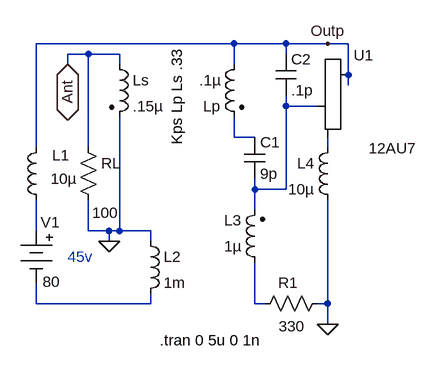
[diagram p0: schematic 6C4_Osc.asc]
6C4_Osc.asc, the LTspice schematic file:
Version 4
SHEET 1 880 680
WIRE -528 256 -528 96
WIRE -528 384 -528 336
WIRE -528 496 -528 464
WIRE -480 128 -480 112
WIRE -448 112 -480 112
WIRE -448 256 -448 112
WIRE -448 384 -448 336
WIRE -416 384 -448 384
WIRE -416 400 -416 384
WIRE -400 112 -448 112
WIRE -400 128 -400 112
WIRE -400 384 -416 384
WIRE -400 384 -400 208
WIRE -352 384 -400 384
WIRE -352 400 -352 384
WIRE -352 496 -528 496
WIRE -352 496 -352 480
WIRE -224 96 -528 96
WIRE -224 128 -224 96
WIRE -224 240 -224 208
WIRE -192 240 -224 240
WIRE -192 320 -192 304
WIRE -192 352 -192 320
WIRE -192 496 -192 432
WIRE -176 496 -192 496
WIRE -144 96 -224 96
WIRE -144 112 -144 96
WIRE -144 192 -144 176
WIRE -144 320 -192 320
WIRE -144 320 -144 192
WIRE -96 192 -144 192
WIRE -80 96 -144 96
WIRE -80 256 -80 240
WIRE -80 496 -96 496
WIRE -80 496 -80 336
WIRE -80 528 -80 496
WIRE -48 96 -80 96
WIRE -48 144 -48 96
WIRE -48 160 -48 144
FLAG -80 528 0
FLAG -416 400 0
FLAG -480 128 Ant
IOPIN -480 128 BiDir
FLAG -80 96 Outp
SYMBOL Valve\\triode -48 192 R0
WINDOW 38 68 65 Center 0
SYMATTR SpiceModel 12AU7
SYMATTR InstName U1
SYMBOL Misc\\battery -528 368 M0
WINDOW 0 -21 -13 Top 0
WINDOW 3 -23 110 Bottom 0
WINDOW 123 0 0 Left 0
SYMATTR InstName V1
SYMATTR Value 80
SYMATTR SpiceLine Rser=1m Cpar=10n
SYMBOL ind -512 352 R180
WINDOW 0 -22 69 Top 0
WINDOW 3 -26 64 Bottom 0
SYMATTR InstName L1
SYMATTR Value 10µ
SYMATTR SpiceLine Ipk=0.21 Rser=1.35 Rpar=0 Cpar=0 mfg="Coilcraft" pn="0603PS-103M"
SYMBOL ind2 -208 112 M0
WINDOW 0 36 80 Left 0
WINDOW 3 36 40 Left 0
SYMATTR InstName Lp
SYMATTR Value .1µ
SYMATTR SpiceLine Ipk=20 Rser=0.00165 Rpar=0 Cpar=0 mfg="WE eiSos" pn="744 312 011"
SYMBOL ind2 -176 448 R180
WINDOW 0 36 80 Left 0
WINDOW 3 36 40 Left 0
SYMATTR InstName L3
SYMATTR Value 1µ
SYMATTR SpiceLine Ipk=4.2 Rser=0.007 Rpar=0 Cpar=0 mfg="Coiltronics" pn="CTX1-1"
SYMBOL res -80 480 R90
WINDOW 0 -16 45 VRight 0
WINDOW 3 51 35 VRight 0
SYMATTR InstName R1
SYMATTR Value 330
SYMATTR SpiceLine tol=1 pwr=0.1
SYMBOL ind -64 240 M0
SYMATTR InstName L4
SYMATTR Value 10µ
SYMATTR SpiceLine Ipk=0.21 Rser=1.35 Rpar=0 Cpar=0 mfg="Coilcraft" pn="0603PS-103M"
SYMBOL cap -208 240 R0
SYMATTR InstName C1
SYMATTR Value 9p
SYMBOL cap -160 112 R0
SYMATTR InstName C2
SYMATTR Value .1p
SYMBOL ind2 -416 112 R0
SYMATTR InstName Ls
SYMATTR Value .15µ
SYMATTR Type ind
SYMATTR SpiceLine Ipk=0.4 Rser=0.26 Rpar=0 Cpar=0
SYMBOL res -464 240 R0
WINDOW 3 22 116 Left 0
SYMATTR Value 100
SYMATTR InstName RL
SYMATTR SpiceLine tol=1 pwr=0.1
SYMBOL ind -368 384 R0
SYMATTR InstName L2
SYMATTR Value 1m
SYMATTR SpiceLine Ipk=0.21 Rser=1.35 Rpar=0 Cpar=0 mfg="Coilcraft" pn="0603PS-103M"
TEXT -338 552 Left 0 !.tran 0 5u 0 1n
TEXT -312 104 VRight 0 !Kps Lp Ls .33
TEXT -480 424 Left 0 ;45v

The netlist it stands for:
* 6C4_Osc.asc
XU1 Outp N004 N006 12AU7
V1 N001 N002 80 Rser=1m Cpar=10n
L1 N001 Outp 10µ Ipk=0.21 Rser=1.35 Rpar=0 Cpar=0 mfg="Coilcraft" pn="0603PS-103M"
Lp Outp N003 .1µ Ipk=20 Rser=0.00165 Rpar=0 Cpar=0 mfg="WE eiSos" pn="744 312 011"
L3 N005 N004 1µ Ipk=4.2 Rser=0.007 Rpar=0 Cpar=0 mfg="Coiltronics" pn="CTX1-1"
R1 0 N005 330 tol=1 pwr=0.1
L4 N006 0 10µ Ipk=0.21 Rser=1.35 Rpar=0 Cpar=0 mfg="Coilcraft" pn="0603PS-103M"
C1 N003 N004 9p
C2 Outp N004 .1p
Ls Ant 0 .15µ Ipk=0.4 Rser=0.26 Rpar=0 Cpar=0
RL Ant 0 100 tol=1 pwr=0.1
L2 0 N002 1m Ipk=0.21 Rser=1.35 Rpar=0 Cpar=0 mfg="Coilcraft" pn="0603PS-103M"
.tran 0 5u 0 1n
Kps Lp Ls .33
* 45v
.backanno
.end